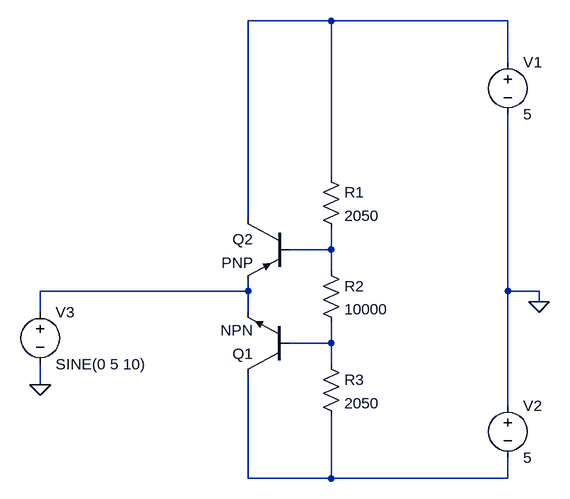
[diagram p0: schematic ACTIVECLAMP.asc]
ACTIVECLAMP.asc, the LTspice schematic file:
Version 4.1
SHEET 1 880 680
WIRE 176 -224 48 -224
WIRE 448 -224 176 -224
WIRE 448 -160 448 -224
WIRE 176 16 176 -224
WIRE 48 80 48 -224
WIRE 176 128 176 96
WIRE 176 128 112 128
WIRE 176 160 176 128
WIRE 48 192 48 176
WIRE 48 192 -272 192
WIRE 448 192 448 -80
WIRE 496 192 448 192
WIRE 496 208 496 192
WIRE -272 224 -272 192
WIRE 48 224 48 192
WIRE 176 272 176 240
WIRE 176 272 112 272
WIRE 176 304 176 272
WIRE -272 336 -272 304
WIRE 448 368 448 192
WIRE 48 480 48 320
WIRE 176 480 176 384
WIRE 176 480 48 480
WIRE 448 480 448 448
WIRE 448 480 176 480
FLAG 496 208 0
FLAG -272 336 0
SYMBOL res 160 0 R0
SYMATTR InstName R1
SYMATTR Value 2050
SYMBOL res 160 144 R0
SYMATTR InstName R2
SYMATTR Value 10000
SYMBOL res 160 288 R0
SYMATTR InstName R3
SYMATTR Value 2050
SYMBOL voltage 448 -176 R0
SYMATTR InstName V1
SYMATTR Value 5
SYMBOL voltage 448 352 R0
SYMATTR InstName V2
SYMATTR Value 5
SYMBOL voltage -272 208 R0
WINDOW 123 0 0 Left 0
WINDOW 39 0 0 Left 0
SYMATTR InstName V3
SYMATTR Value SINE(0 5 10)
SYMBOL npn 112 320 R180
SYMATTR InstName Q1
SYMBOL pnp 112 80 M0
SYMATTR InstName Q2

The netlist it stands for:
* ACTIVECLAMP.asc
R1 N001 N002 2050
R2 N002 N004 10000
R3 N004 N005 2050
V1 N001 0 5
V2 0 N005 5
V3 N003 0 SINE(0 5 10)
Q1 N005 N004 N003 0 NPN
Q2 N001 N002 N003 0 PNP
.model NPN NPN
.model PNP PNP
.lib standard.bjt
.backanno
.end